# EAGLE design Mag4_V2 (EAGLE 9.6.2)
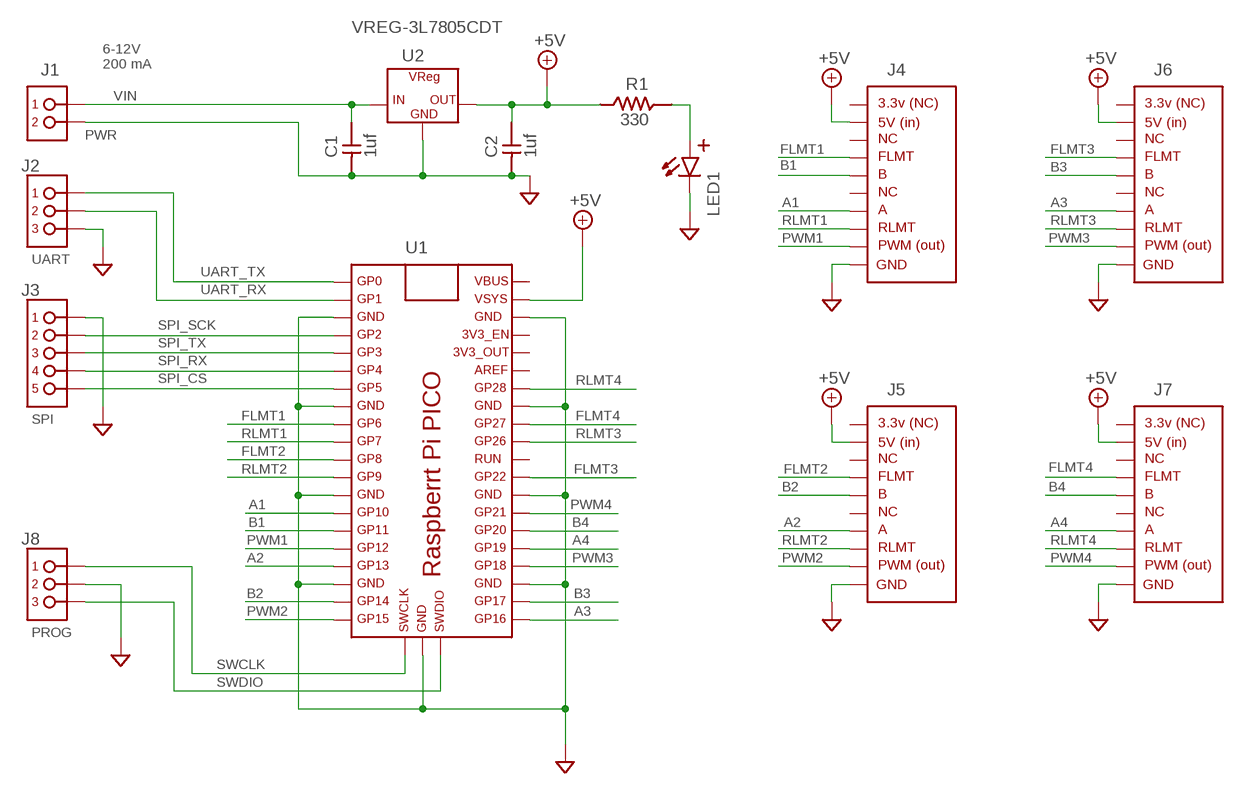
[diagram p0: schematic, sheet 1]

## Parts
C1  1uf  CAP0805  [C0805]
C2  1uf  CAP0805  [C0805]
J1  PINHDR_1X2-JST  [JST-XH_098_VERT_1X2]
J2  PINHDR_1X3XH-JST  [JST-XH_098_VERT_1X3]
J3  PINHDR_1X5-JST  [JST-XH_098_VERT_1X5]
J4  MAG_ENCODER_CON  [PINHDR_SMD_050_5X2]
J5  MAG_ENCODER_CON  [PINHDR_SMD_050_5X2]
J6  MAG_ENCODER_CON  [PINHDR_SMD_050_5X2]
J7  MAG_ENCODER_CON  [PINHDR_SMD_050_5X2]
J8  PINHDR_1X3-100  [PINHDR_TH_100_1X3]
LED1  LED1206  [LED_1206]
R1  330  R1206(3216METRIC)  [R1206]
U1  RASPBERRY_PI_PICOSMD  [RASP_PI_PICO_SMD]
U2  VREG-3L7805CDT  [TO252-3]

## Nets
+5V: C2.2 J4.2 J5.2 J6.2 J7.2 R1.P$1 U1.P$39(VSYS) U2.3(OUT)
A1: J4.7 U1.P$14(GP10)
A2: J5.7 U1.P$17(GP13)
A3: J6.7 U1.P$21(GP16)
A4: J7.7 U1.P$25(GP19)
B1: J4.5 U1.P$15(GP11)
B2: J5.5 U1.P$19(GP14)
B3: J6.5 U1.P$22(GP17)
B4: J7.5 U1.P$26(GP20)
FLMT1: J4.4 U1.P$9(GP6)
FLMT2: J5.4 U1.P$11(GP8)
FLMT3: J6.4 U1.P$29(GP22)
FLMT4: J7.4 U1.P$32(GP27)
GND: C1.1 C2.1 J1.2 J2.1 J3.1 J4.10 J5.10 J6.10 J7.10 J8.2 LED1.CATHODE(-)(CATHODE) U1.P$3(GND1) U1.P$8(GND2) U1.P$13(GND3) U1.P$18(GND4) U1.P$23(GND5) U1.P$28(GND6) U1.P$33(GND7) U1.P$38(GND8) U1.P$42(GND_DEBUG) U2.FIN(GND)
N$1: LED1.ANODE(+)(ANODE) R1.P$2
PWM1: J4.9 U1.P$16(GP12)
PWM2: J5.9 U1.P$20(GP15)
PWM3: J6.9 U1.P$24(GP18)
PWM4: J7.9 U1.P$27(GP21)
RLMT1: J4.8 U1.P$10(GP7)
RLMT2: J5.8 U1.P$12(GP9)
RLMT3: J6.8 U1.P$31(GP26)
RLMT4: J7.8 U1.P$34(GP28)
SPI_CS: J3.5 U1.P$7(GP5)
SPI_RX: J3.4 U1.P$6(GP4)
SPI_SCK: J3.2 U1.P$4(GP2)
SPI_TX: J3.3 U1.P$5(GP3)
SWCLK: J8.1 U1.P$41(SWCLK)
SWDIO: J8.3 U1.P$43(SWDIO)
UART_RX: J2.2 U1.P$2(GP1)
UART_TX: J2.3 U1.P$1(GP0)
VIN: C1.2 J1.1 U2.1(IN)
Unconnected: J4.1 J4.3 J4.6 J5.1 J5.3 J5.6 J6.1 J6.3 J6.6 J7.1 J7.3 J7.6 U1.P$30(RUN) U1.P$35(AREF) U1.P$36(3.3_OUT) U1.P$37(3.3_EN) U1.P$40(VBUS)

## Notes on the sheet
- 6-12V
  200 mA
- PWR
- UART
- SPI
- PROG

## Library data of the parts
C1 C2 = Dal_V2:CAP
J1 = Dal_V2:PINHDR_1X2
J2 J8 = Dal_V2:PINHDR_1X3
J3 = Dal_V2:PINHDR_1X5
J4-J7 = Dal_V2:MAG_ENCODER_CON
LED1 = Dal_V2:LED: Standard LED
R1 = Dal_V2:R: Standard Resistor -- Various Sizes and Wattages
U1 = Dal_V2:RASPBERRY_PI_PICO: Raspberry PI PICO Board
U2 = Dal_V2:VREG-3: 3 Pin Voltage Regulator

## Board
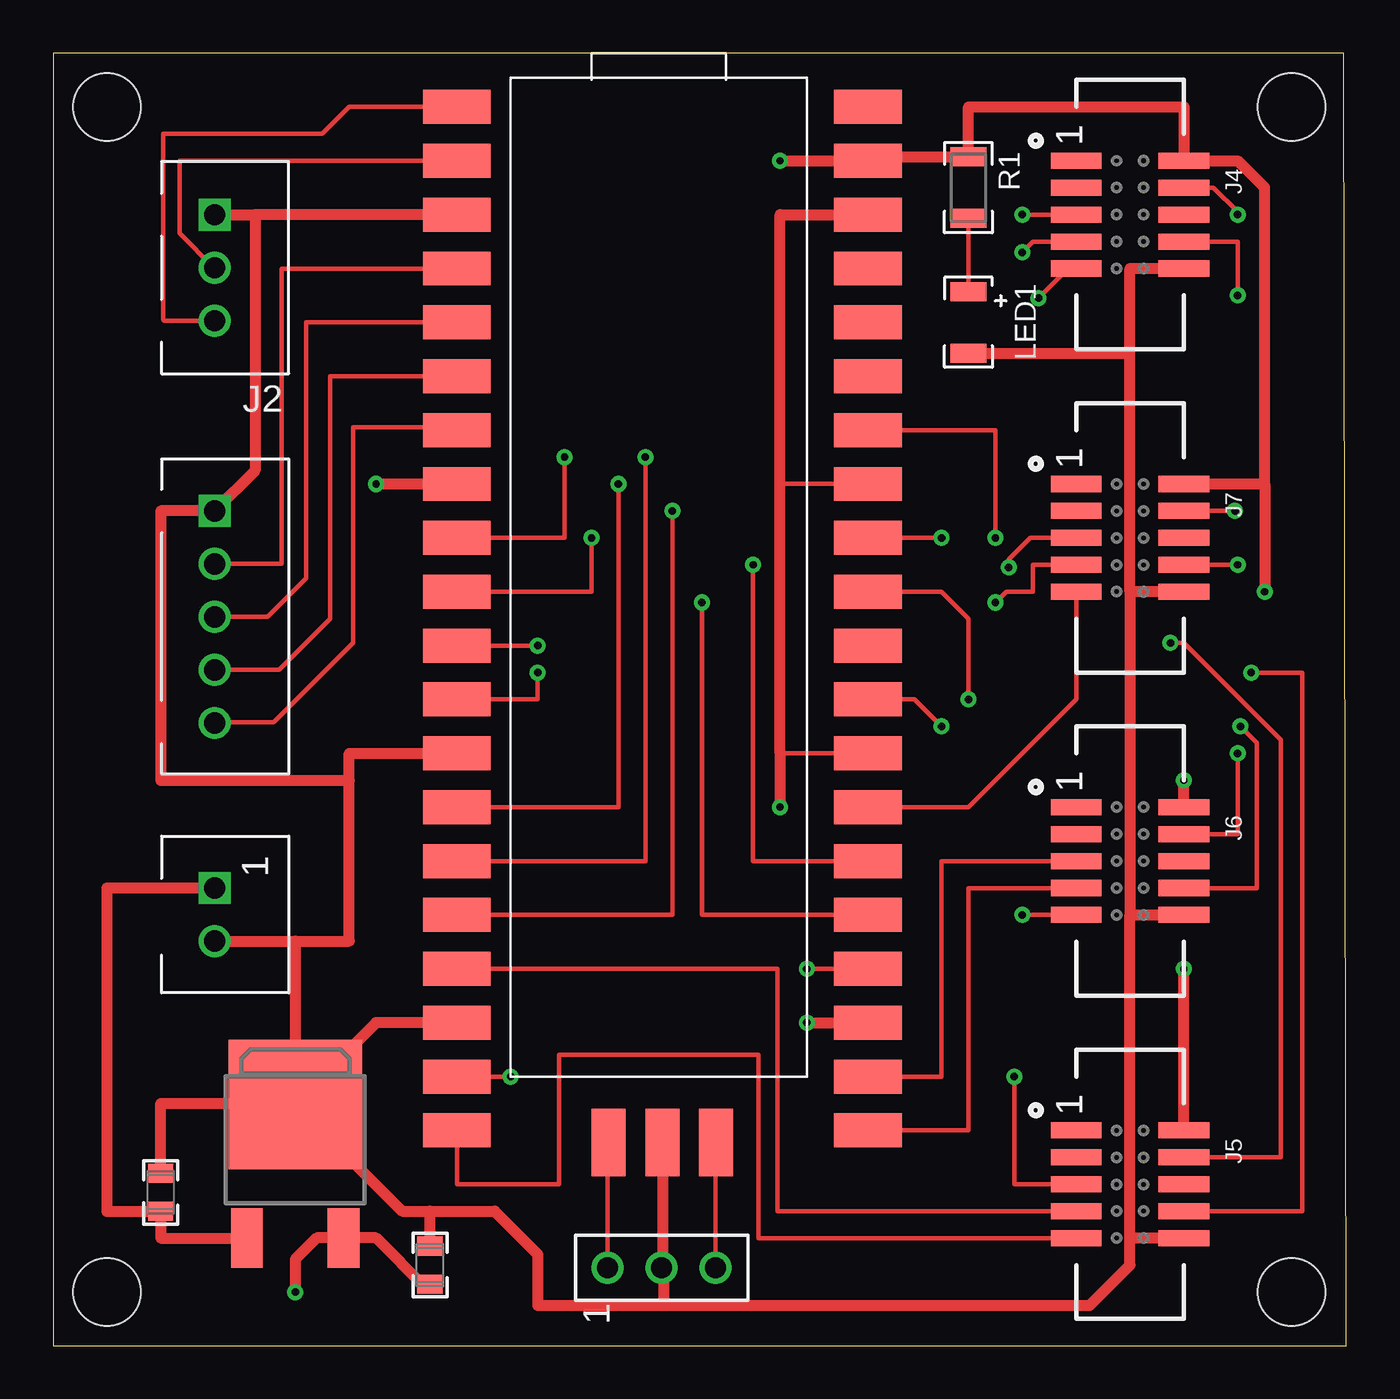
[diagram p1: board, top side]
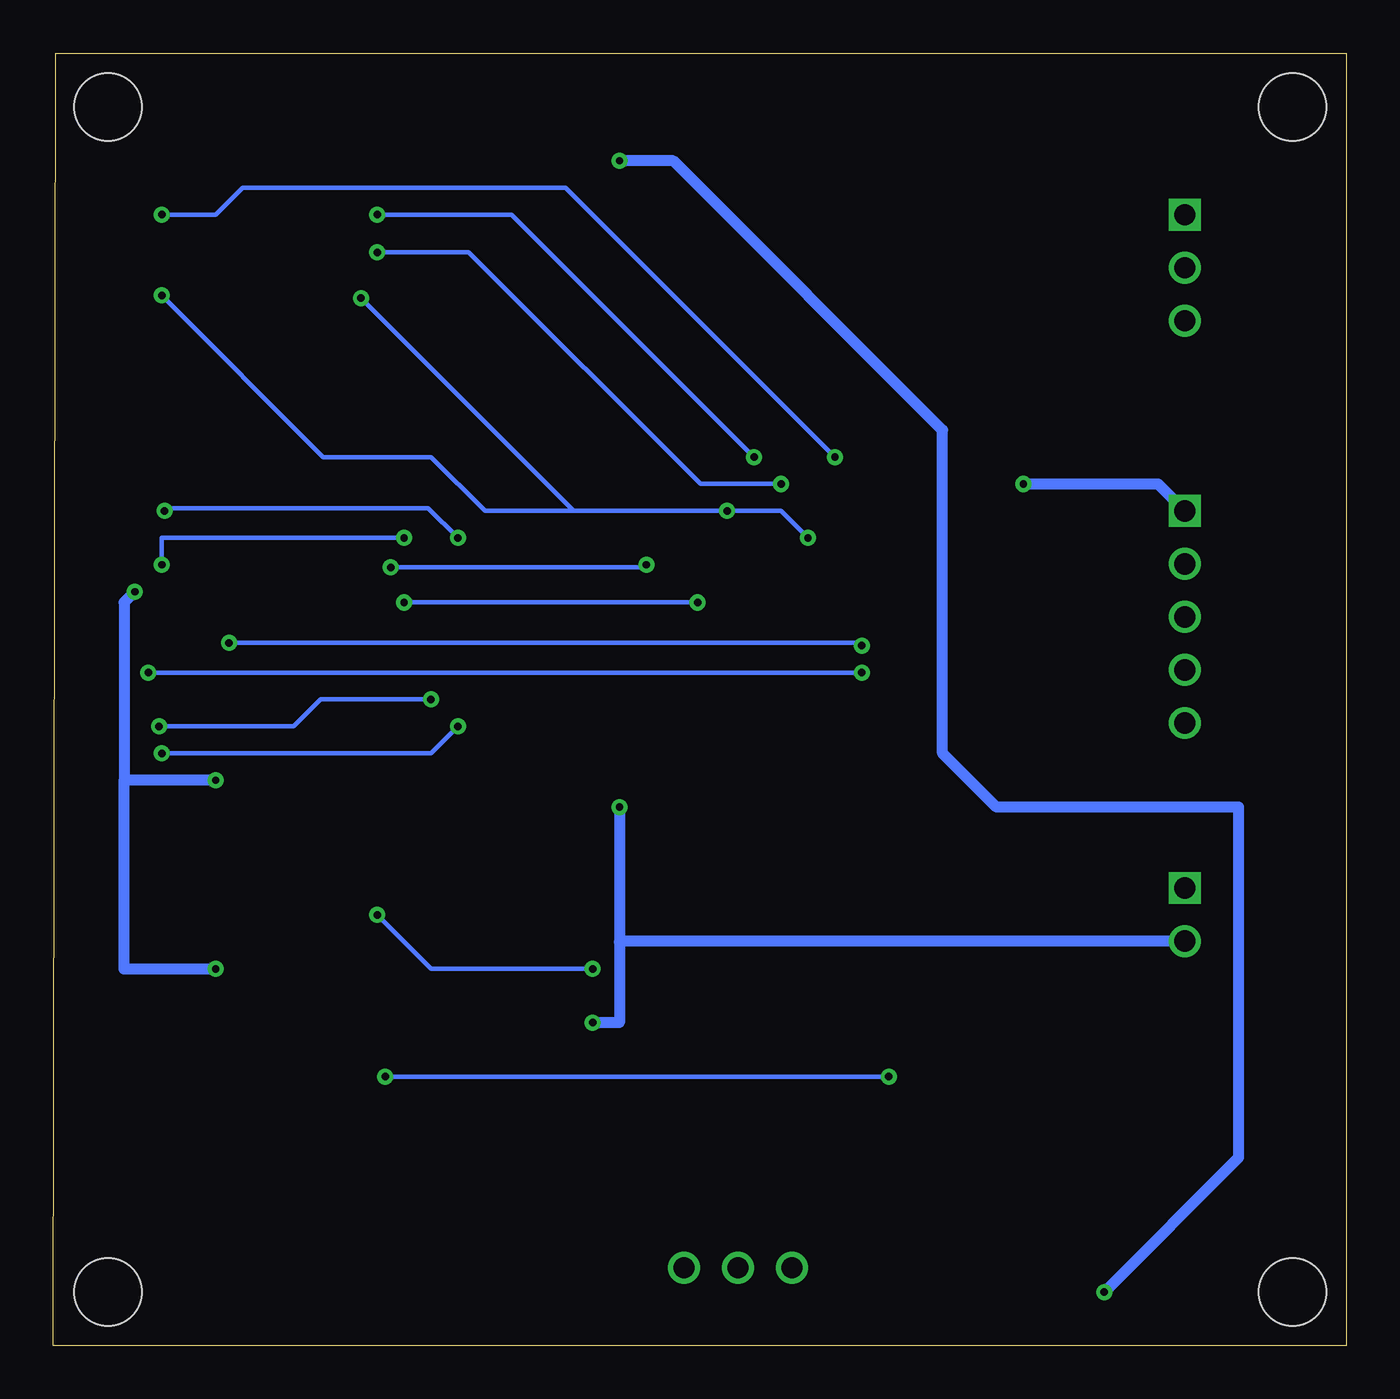
[diagram p2: board, bottom side, seen from below]

Size 61.01 x 60.96 mm. Coordinates in mm from the lower left corner, seen from the top.
Outline: 0,60.95 60.88,60.95 61.01,0 0,0 0,60.96
Copper layers (1*16): Top 0.035mm / dielectric 1.5mm / Bottom 0.035mm
Design rules "default *": minimum track width 8mil, minimum drill 0.35mm, track to track 8mil, track to pad 8mil, pad to pad 8mil, via to via 8mil, smd to smd 8mil, copper to edge 40mil, drill to drill 8mil, minimum pad ring 10mil, minimum via ring 8mil, stop-mask expansion 4mil, vias tented up to drill 15mil, thermal gap 10mil
Holes 3.17 mm at 2.54,2.54 58.42,2.54 58.42,58.42 2.54,58.42

### Footprints (pad centres in the part's own frame; a part is rotated, then mirrored left to right if it is on the bottom)
C0805 = smd 0.9 x 1.2: 1 -0.9,0; 2 0.9,0
JST-XH_098_VERT_1X2 = drill 1 square: 1 0,0 | drill 1: 2 -2.5,0
JST-XH_098_VERT_1X3 = drill 1 square: 1 0,0 | drill 1: 2 -2.5,0; 3 -5,0
JST-XH_098_VERT_1X5 = drill 1 square: 1 0,0 | drill 1: 2 -2.5,0; 3 -5,0; 4 -7.5,0; 5 -10,0
PINHDR_SMD_050_5X2 = smd 0.76 x 2.4: 1 0,-2.54; 2 0,2.54; 3 1.27,-2.54; 4 1.27,2.54; 5 2.54,-2.54; 6 2.54,2.54; 7 3.81,-2.54; 8 3.81,2.54; 9 5.08,-2.54; 10 5.08,2.54
PINHDR_TH_100_1X3 = drill 1: 1 -2.54,0; 2 0,0; 3 2.54,0
LED_1206 = smd 0.9 x 1.7: ANODE(+) -1.45,0; CATHODE(-) 1.45,0
R1206 = smd 0.9 x 1.7: P$1 -1.45,0; P$2 1.45,0
RASP_PI_PICO_SMD = smd 3.2 x 1.6: P$1 0,0; P$2 0,-2.54; P$3 0,-5.08; P$4 0,-7.62; P$5 0,-10.16; P$6 0,-12.7; P$7 0,-15.24; P$8 0,-17.78; P$9 0,-20.32; P$10 0,-22.86; P$11 0,-25.4; P$12 0,-27.94; P$13 0,-30.48; P$14 0,-33.02; P$15 0,-35.56; P$16 0,-38.1; P$17 0,-40.64; P$18 0,-43.18; P$19 0,-45.72; P$20 0,-48.26; P$21 19.38,-48.26; P$22 19.38,-45.72; P$23 19.38,-43.18; P$24 19.38,-40.64; P$25 19.38,-38.1; P$26 19.38,-35.56; P$27 19.38,-33.02; P$28 19.38,-30.48; P$29 19.38,-27.94; P$30 19.38,-25.4; P$31 19.38,-22.86; P$32 19.38,-20.32; P$33 19.38,-17.78; P$34 19.38,-15.24; P$35 19.38,-12.7; P$36 19.38,-10.16; P$37 19.38,-7.62; P$38 19.38,-5.08; P$39 19.38,-2.54; P$40 19.38,0 | smd 1.6 x 3.2: P$41 7.15,-48.83; P$42 9.69,-48.83; P$43 12.23,-48.83
TO252-3 = smd 1.5 x 2.8: 1 -2.28,-3.8; 3 2.28,-3.8 | smd 6.3 x 6.1: FIN 0,2.5

### Placement (x,y rotation side)
C1  5.08,7.24 270 top
C2  17.78,3.81 270 top
J1  7.62,21.59 90 top
J2  7.62,53.34 90 top
J3  7.62,39.37 90 top
J4  50.8,55.88 270 top
J5  50.8,10.16 270 top
J6  50.8,25.4 270 top
J7  50.8,40.64 270 top
J8  28.7,3.68 0 top
LED1  43.18,48.26 270 top
R1  43.18,54.61 270 top
U1  19.05,58.42 0 top
U2  11.43,8.89 0 top

### Tracks (layer width: path | path; a pad name or v marks a point on that pad's centre or on a via)
+5V  (via drill 0.35)
  Top 0.203: 17.59,2.73 C2.2
  Top 0.508: J7.2 57.15,40.64 | 57.15,40.64 v57.15,35.56 | 57.15,40.64 57.15,54.61 55.88,55.88 J4.2 53.34,58.42 43.18,58.42 R1.P$1 38.61,56.06 U1.P$39 v34.29,55.88 | J5.2 v53.34,17.78 | v11.43,2.54 11.43,4.08 12.44,5.09 U2.3 15.23,5.09 17.59,2.73 | J6.2 v53.34,26.67
  Bottom 0.508: v53.34,17.78 57.66,17.78 57.66,26.67 | v11.43,2.54 5.08,8.89 5.08,25.4 16.51,25.4 19.05,27.94 19.05,43.18 31.75,55.88 v34.29,55.88 | v53.34,26.67 57.66,26.67 | v57.15,35.56 57.66,35.05 57.66,26.67
A1  (via drill 0.35)
  Top 0.203: U1.P$14 26.67,25.4 v26.67,40.64 | v45.72,51.56 46.23,52.07 J4.7
  Bottom 0.203: v26.67,40.64 30.48,40.64 41.4,51.56 v45.72,51.56
A2
  Top 0.203: J5.7 34.16,6.35 34.16,17.78 U1.P$17
A3
  Top 0.203: U1.P$21 43.18,10.16 43.18,21.59 J6.7
A4  (via drill 0.35)
  Top 0.203: v30.61,35.05 30.61,20.32 U1.P$25 | v44.45,35.05 44.96,35.56 46.23,35.56 46.23,36.83 J7.7
  Bottom 0.203: v44.45,35.05 v30.61,35.05
B1  (via drill 0.35)
  Top 0.203: U1.P$15 27.94,22.86 v27.94,41.91 | v45.72,53.34 J4.5
  Bottom 0.203: v45.72,53.34 39.37,53.34 v27.94,41.91
B2  (via drill 0.35)
  Top 0.203: J5.5 45.34,7.62 v45.34,12.7 | v21.59,12.7 U1.P$19
  Bottom 0.203: v45.34,12.7 v21.59,12.7
B3
  Top 0.203: U1.P$22 41.91,12.7 41.91,22.86 J6.5
B4  (via drill 0.35)
  Top 0.203: v33.02,36.83 33.02,22.86 U1.P$26 | v45.09,36.7 45.09,37.08 46.1,38.1 J7.5
  Bottom 0.203: v45.09,36.7 33.15,36.7 v33.02,36.83
FLMT1  (via drill 0.35)
  Top 0.203: U1.P$9 24.13,38.1 v24.13,41.91 | v55.88,53.34 55.88,53.47 54.74,54.61 J4.4
  Bottom 0.203: v55.88,53.34 53.34,53.34 52.07,54.61 36.83,54.61 v24.13,41.91
FLMT2  (via drill 0.35)
  Top 0.203: J5.4 57.91,8.89 57.91,28.57 53.34,33.15 v52.7,33.15 | v22.86,33.02 U1.P$11
  Bottom 0.203: v52.7,33.15 22.99,33.15 v22.86,33.02
FLMT3  (via drill 0.35)
  Top 0.203: J6.4 55.88,24.13 v55.88,27.94 | v41.91,29.21 40.64,30.48 U1.P$29
  Bottom 0.203: v55.88,27.94 43.18,27.94 v41.91,29.21
FLMT4  (via drill 0.35)
  Top 0.203: v41.91,38.1 U1.P$32 | v55.75,39.37 J7.4
  Bottom 0.203: v55.75,39.37 55.63,39.5 43.31,39.5 v41.91,38.1
GND  (via drill 0.35)
  Top 0.203: U1.P$28 34.29,27.94 | 34.29,40.64 U1.P$33 | 11.45,11.41 U2.FIN
  Top 0.508: J2.1 9.53,53.34 | 9.53,53.34 9.53,41.27 J3.1 5.08,39.37 5.08,26.67 13.97,26.67 | U1.P$3 9.53,53.34 | J1.2 11.43,19.09 | 11.43,19.09 13.97,19.09 13.97,26.67 | 13.97,26.67 13.97,27.94 U1.P$13 | v15.24,40.64 U1.P$8 | J5.10 50.8,5.08 | 50.8,5.08 50.8,20.32 | 50.8,20.32 J6.10 | 50.8,35.56 50.8,20.32 | J7.10 50.8,35.56 | J4.10 50.8,50.8 50.8,46.99 | 50.8,35.56 50.8,46.99 | v35.56,15.24 U1.P$23 | v34.29,25.4 34.29,27.94 34.29,40.64 34.29,53.34 U1.P$38 | 11.43,19.09 11.43,11.43 11.45,11.41 11.45,11.45 15.24,15.24 U1.P$18 | U1.P$42 28.74,3.72 | 28.74,3.72 J8.2 | 17.78,6.35 16.47,6.35 U2.FIN 11.39,11.43 5.08,11.43 C1.1 | C2.1 17.78,6.35 | 17.78,6.35 20.83,6.35 22.86,4.32 22.86,1.91 28.83,1.91 | 28.83,1.91 28.83,3.63 28.74,3.72 | LED1.CATHODE(-) 50.62,46.81 50.8,46.99 | 28.83,1.91 48.9,1.91 50.8,3.81 50.8,5.08
  Bottom 0.508: J3.1 8.89,40.64 v15.24,40.64 | v34.29,25.4 34.29,19.05 | 34.29,19.05 34.29,15.24 v35.56,15.24 | J1.2 34.25,19.09 34.29,19.05
N$1
  Top 0.203: R1.P$2 LED1.ANODE(+)
PWM1  (via drill 0.35)
  Top 0.203: U1.P$16 29.21,20.32 v29.21,39.37 | J4.9 47.88,50.8 v46.48,49.4
  Bottom 0.203: v46.48,49.4 36.45,39.37 v29.21,39.37
PWM2
  Top 0.203: J5.9 33.27,5.08 33.27,13.72 23.88,13.72 23.88,7.62 19.05,7.62 U1.P$20
PWM3  (via drill 0.35)
  Top 0.203: U1.P$24 v35.56,17.78 | v45.72,20.32 J6.9
  Bottom 0.203: v45.72,20.32 43.18,17.78 v35.56,17.78
PWM4
  Top 0.203: J7.9 48.26,30.48 43.18,25.4 U1.P$27
RLMT1  (via drill 0.35)
  Top 0.203: U1.P$10 25.4,35.56 v25.4,38.1 | v55.88,49.53 55.88,52.07 J4.8
  Bottom 0.203: v55.88,49.53 48.26,41.91 43.18,41.91 40.64,39.37 26.67,39.37 v25.4,38.1
RLMT2  (via drill 0.35)
  Top 0.203: J5.8 58.93,6.35 58.93,31.75 v56.52,31.75 | v22.86,31.75 22.86,30.48 U1.P$12
  Bottom 0.203: v56.52,31.75 v22.86,31.75
RLMT3  (via drill 0.35)
  Top 0.203: U1.P$31 41.91,35.56 43.18,34.29 v43.18,30.48 | v56.01,29.21 56.77,28.45 56.77,21.59 J6.8
  Bottom 0.203: v43.18,30.48 48.39,30.48 49.66,29.21 v56.01,29.21
RLMT4  (via drill 0.35)
  Top 0.203: v44.45,38.1 44.45,43.18 U1.P$34 | v55.88,36.83 J7.8
  Bottom 0.203: v55.88,36.83 55.88,38.1 v44.45,38.1
SPI_CS
  Top 0.203: U1.P$7 18.92,43.31 14.15,43.31 14.15,33.15 10.41,29.41 7.66,29.41 J3.5
SPI_RX
  Top 0.203: J3.4 10.67,31.88 13.08,34.29 13.08,45.72 U1.P$6
SPI_SCK
  Top 0.203: J3.2 10.79,36.87 10.79,50.8 U1.P$4
SPI_TX
  Top 0.203: U1.P$5 11.94,48.26 11.94,36.2 10.11,34.37 J3.3
SWCLK
  Top 0.203: J8.1 26.16,9.55 U1.P$41
SWDIO
  Top 0.203: J8.3 31.24,9.55 U1.P$43
UART_RX
  Top 0.203: U1.P$2 5.97,55.88 5.97,52.45 7.58,50.84 J2.2
UART_TX
  Top 0.203: U1.P$1 13.97,58.42 12.7,57.15 5.21,57.15 5.21,48.39 5.25,48.34 J2.3
VIN
  Top 0.508: J1.1 2.54,21.59 2.54,6.35 2.55,6.34 C1.2 5.08,5.08 U2.1

### Text on the board
Document: GND | TX | PORT 1 | RX | UART | Raspberry / Pi / PICO | GND | SCK | PORT 2 | TX | Mag4 Interface | SPI | RX | CS | V1 | Summer 2023 | +12 | PORT 3 | GND | PWR | G | PROG | EPIC Robotz | PORT 4 | DIO | DLB | SWCLK